# Altium schematic sheet Sensor Board.SchDoc
size 420 x 297 mm; Dosya adı / File Name: Sensor Board; Tanım / Description: Wireless Security Detector; Hazırlayan / Prepared By: MFY; Kontrol eden / Checked by: MFY; Onaylayan  /Approved by: MFY; Bölüm / Department: R&D - ARGE; Yayın Tarihi / Rel.date: 11.08.2025; Değ. tarihi / change date: 11.08.2025; Revizyon / Revision: AA; Size: A3
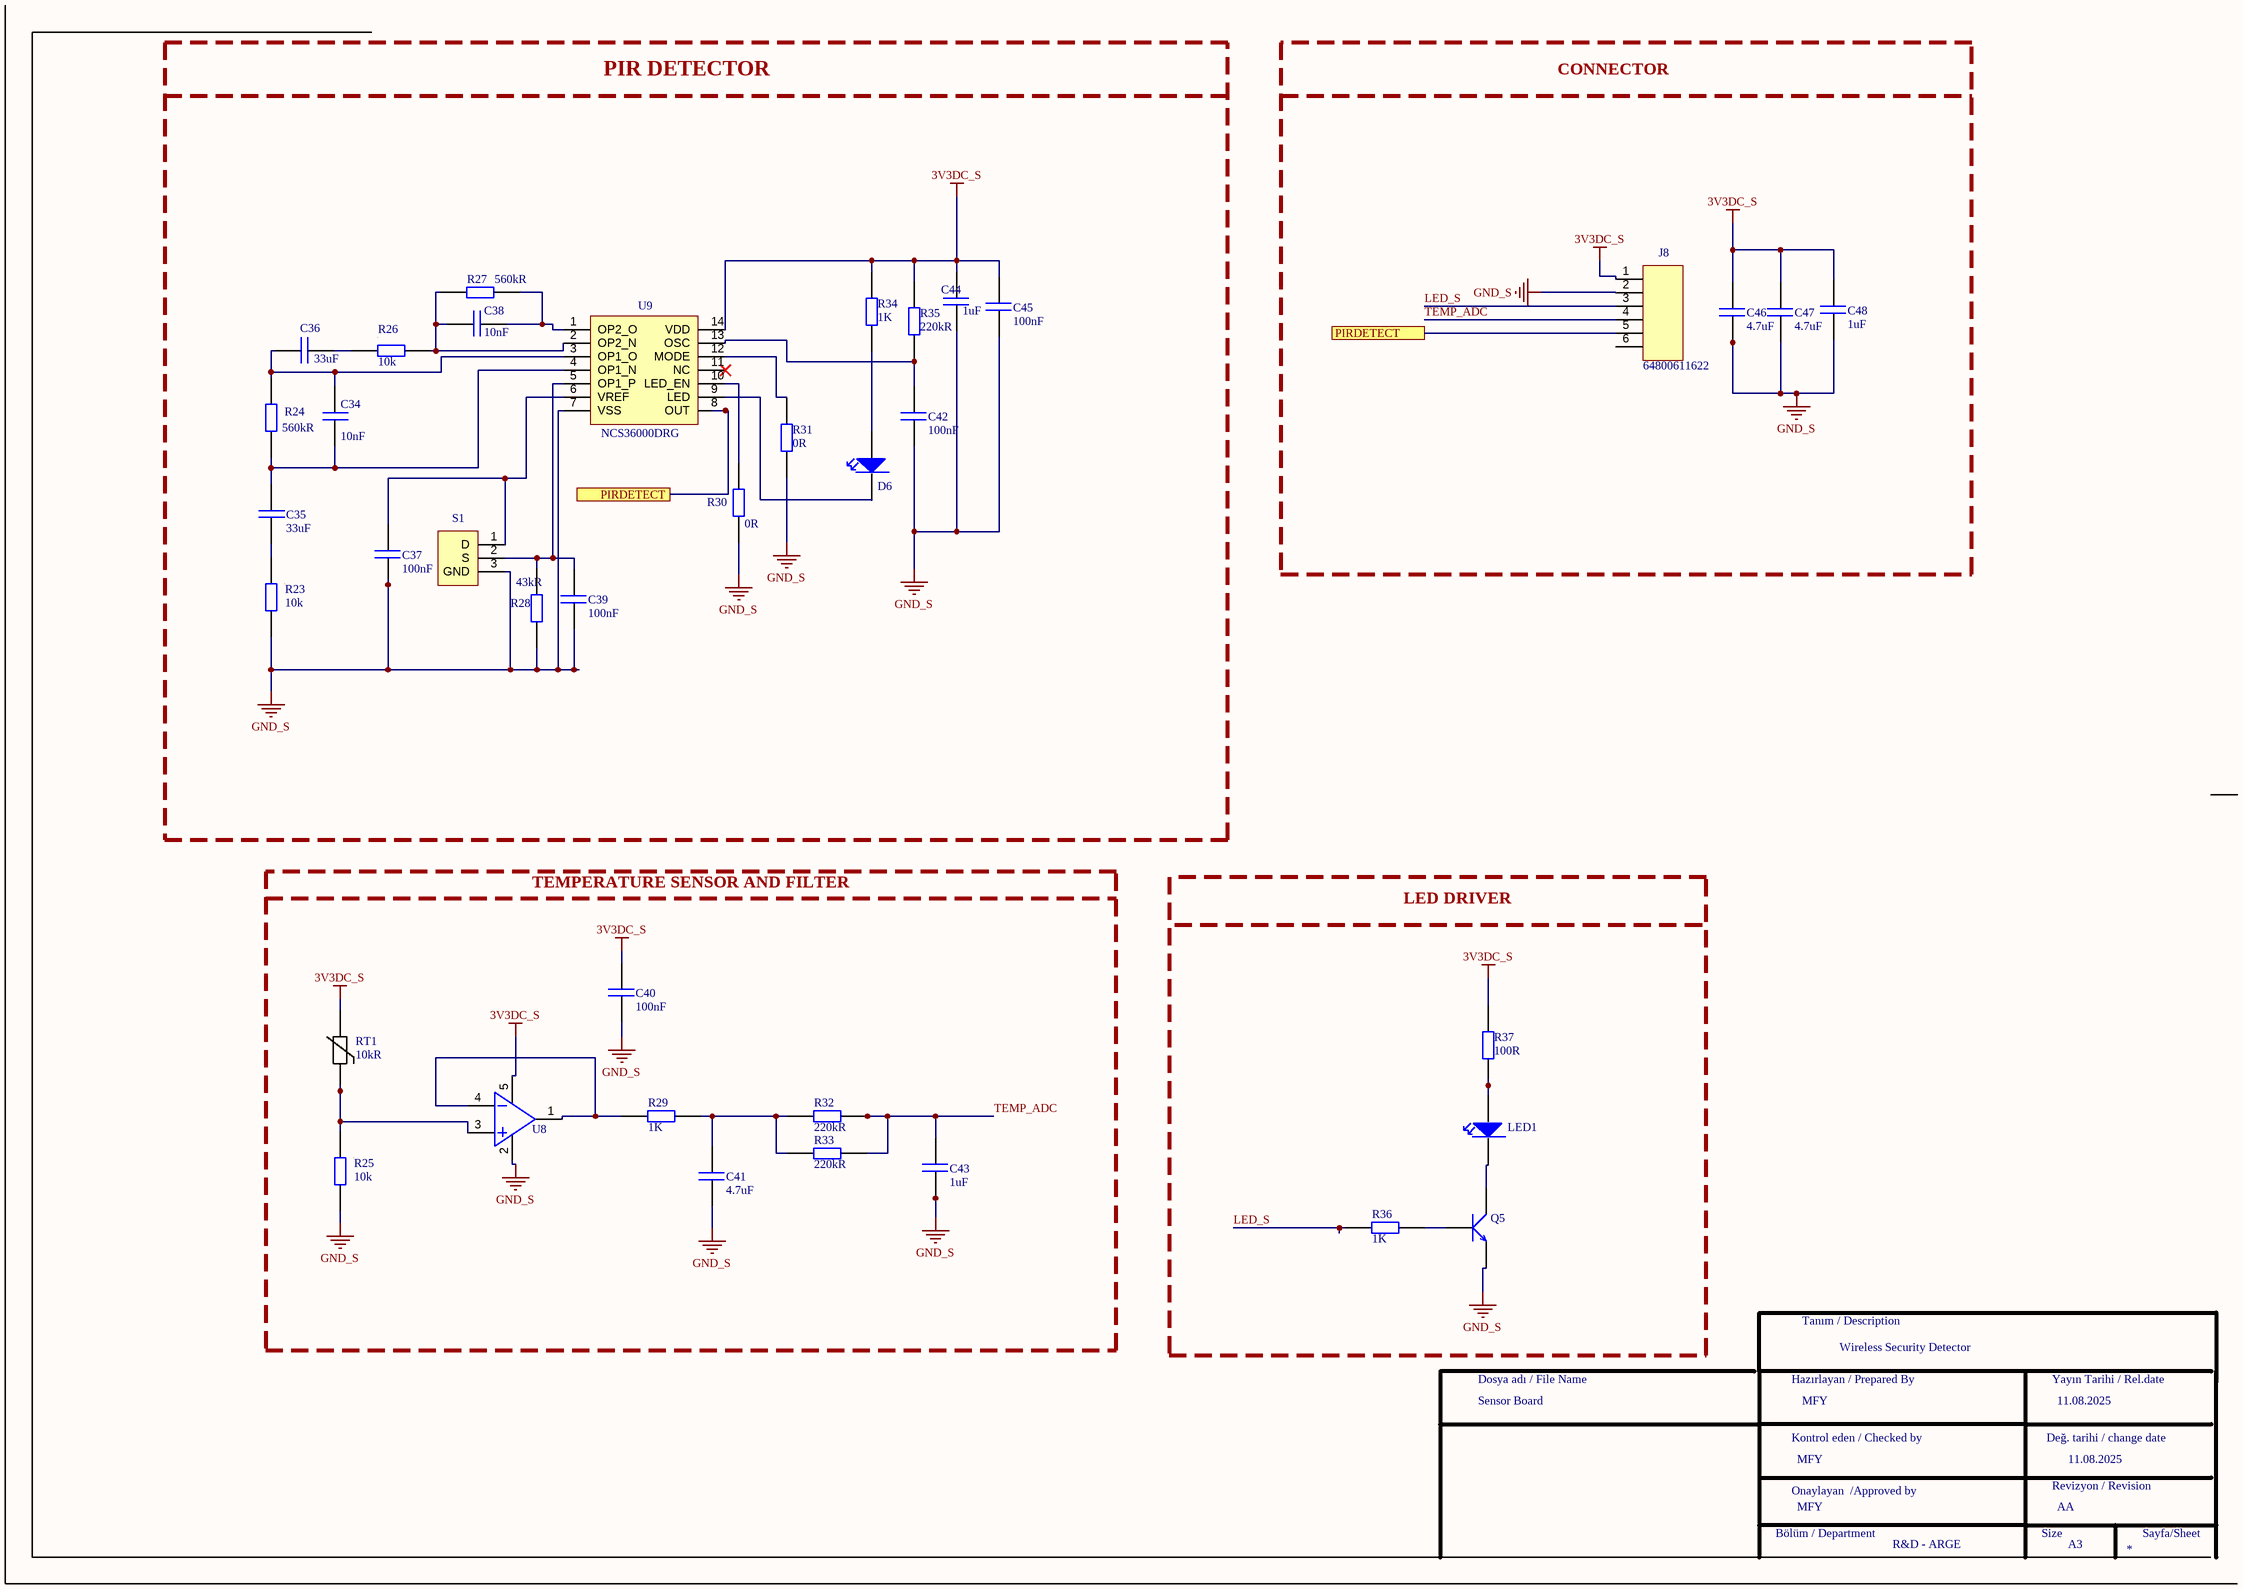
[diagram p0: Sensor Board.SchDoc]

## Parts
C34  value 10nF  [CAP_0603]  (hidden comment: 0603B103K160CT)
C35  value 33uF  [CAP_1206]  (hidden comment: C3216X5R1E336M160AC)
C36  value 33uF  [CAP_1206]  (hidden comment: C3216X5R1E336M160AC)
C37  value 100nF  [CAP_0603]  (hidden comment: CAP CER 100nF 0603)
C38  value 10nF  [CAP_0603]  (hidden comment: 0603B103K160CT)
C39  value 100nF  [CAP_0603]  (hidden comment: CAP CER 100nF 0603)
C40  value 100nF  [CAP_0603]  (hidden comment: CAP CER 100nF 0603)
C41  value 4.7uF  [CAP_0805]  (hidden comment: CL21A475KAQNNNE)
C42  value 100nF  [CAP_0603]  (hidden comment: CAP CER 100nF 0603)
C43  value 1uF  [CAP_0805]  (hidden comment: CL21B105KBFNNNE)
C44  value 1uF  [CAP_0805]  (hidden comment: CL21B105KBFNNNE)
C45  value 100nF  [CAP_0603]  (hidden comment: CAP CER 100nF 0603)
C46  value 4.7uF  [CAP_0805]  (hidden comment: CL21A475KAQNNNE)
C47  value 4.7uF  [CAP_0805]  (hidden comment: CL21A475KAQNNNE)
C48  value 1uF  [CAP_0805]  (hidden comment: CL21B105KBFNNNE)
D6  LTST-C171GKT  [LED_GREEN_0805]  (value not drawn)
J8  64800611622  [64800611622_WÜRTH_CONN]
LED1  LH R974-LP-1  [LED_RED_0805]  (value not drawn)
Q5  MMBT3904-7-F  [SOT23-F]  (value not drawn)
R23  value 10k  [RES_0603]  (hidden comment: RC0603FR-0710KL)
R24  value 560kR  [RES_0603]  (hidden comment: RC0603JR-07560KL)
R25  value 10k  [RES_0603]  (hidden comment: RC0603FR-0710KL)
R26  value 10k  [RES_0603]  (hidden comment: RC0603FR-0710KL)
R27  value 560kR  [RES_0603]  (hidden comment: RC0603JR-07560KL)
R28  value 43kR  [RES_0603]  (hidden comment: RC0603JR-0743KL)
R29  value 1K  [RES_0603]  (hidden comment: RES 1K OHM 0603)
R30  value 0R  [RES_0603]  (hidden comment: RC0603JR-070RL)
R31  value 0R  [RES_0603]  (hidden comment: RC0603JR-070RL)
R32  value 220kR  [RES_0603]  (hidden comment: RC0603JR-07220KL)
R33  value 220kR  [RES_0603]  (hidden comment: RC0603JR-07220KL)
R34  value 1K  [RES_0603]  (hidden comment: RES 1K OHM 0603)
R35  value 220kR  [RES_0603]  (hidden comment: RC0603JR-07220KL)
R36  value 1K  [RES_0603]  (hidden comment: RES 1K OHM 0603)
R37  value 100R  [RES_0603]  (hidden comment: RES 100 OHM 0603)
RT1  value 10kR  [RES_1206]  (hidden comment: TFPT1206L1002FM)
S1  LHI 878/3902  [LHI 878/3902]  (value not drawn)
U8  OPA314AIDBVR  [SOT23-5]  (value not drawn)
U9  NCS36000DRG  [SOIC14]

## Blocks framed on the sheet
PIR DETECTOR: C34-C39 C42 C44 C45 D6 R23 R24 R26-R28 R30 R31 R34 R35 S1 U9
CONNECTOR: C46-C48 J8
TEMPERATURE SENSOR AND FILTER: C40 C41 C43 R25 R29 R32 R33 RT1 U8

## Ports
PIRDETECT (see Sensor Board[2B]), PIRDETECT (see Sensor Board[4A])

## Nets
3V3DC_S: C40.2 C44.2 C45.2 C46.2 C47.2 C48.2 J8.1(VCC) R34.2 R35.2 R37.1 RT1.2 U8.5 U9.14(VDD)
GND_S: C37.1 C39.1 C40.1 C41.1 C42.1 C43.1 C44.1 C45.1 C46.1 C47.1 C48.1 J8.2(RX) Q5.2(E) R23.2 R25.2 R28.1 R30.1 R31.1 S1.3(GND) U8.2 U9.7(VSS)
LED_S: J8.3(RX) R36.1
PIRDETECT: J8.5(GND) U9.8(OUT) ; port PIRDETECT
TEMP_ADC: C43.2 J8.4(NC) R32.2 R33.2
NetC34_1: C34.1 C36.1 R24.1 U9.3(OP1_O)
NetC34_2: C34.2 C35.1 R24.2 U9.4(OP1_N)
NetC35_2: C35.2 R23.1
NetC36_2: C36.2 R26.1
NetC37_2: C37.2 S1.1(D) U9.6(VREF)
NetC38_1: C38.1 R26.2 R27.1 U9.2(OP2_N)
NetC38_2: C38.2 R27.2 U9.1(OP2_O)
NetC39_2: C39.2 R28.2 S1.2(S) U9.5(OP1_P)
NetC41_2: C41.2 R29.2 R32.1 R33.1
NetC42_2: C42.2 R35.1 U9.13(OSC)
NetD6_1: D6.1 U9.9(LED)
NetD6_2: D6.2 R34.1
NetLED1_1: LED1.1 Q5.3(C)
NetLED1_2: LED1.2 R37.2
NetQ5_1: Q5.1(B) R36.2
NetR25_1: R25.1 RT1.1 U8.3
NetR29_1: R29.1 U8.1 U8.4
NetR30_2: R30.2 U9.10(LED_EN)
NetR31_2: R31.2 U9.12(MODE)

Not connected (* = marked no-connect by the designer): J8 6(GND); U9 11(NC)*

## Notes on the sheet
- LED DRIVER
- Tanım / Description
- Dosya adı / File Name
- Hazırlayan / Prepared By
- Yayın Tarihi / Rel.date
- Kontrol eden / Checked by
- Değ. tarihi / change date
- Bölüm / Department
- Onaylayan  /Approved by
- Size
- Revizyon / Revision
- Sayfa/Sheet

## Library data of the parts
C34 C38 = CAP CER 10nF 0603: Ceramic Capacitor, Multilayer, Ceramic, 16V, 10% +Tol, 10% -Tol, X7R, 15% TC, 0.01uF, Surface Mount, 0603; Manufacturer: Walsin Technologies; Multilayer: Yes; Supplier: Mouser; Supplier Part Number: 791-0603B103K160CT; Manufacturer Part Number: 0603B103K160CT; RoHS: Yes; Category: Ceramic Capacitors; Stock: 5599; Pricing: 1=0,1, 10=0,017, 50=0,017, 100=0,01, 1000=0,006, 10000=0,003 (USD); Mounting Technology: Surface Mount; Pins: 2; Dielectric Material: Ceramic; Case/Package: 0603; Package Shape: Rectangular; Terminal Finish: Nickel; Min Operating Temperature: -55°C; Max Operating Temperature: 125°C; Capacitor Type: Ceramic; Tolerance  (fill in as +-): 10%; Package Style: SMTMeter; Packaging: Tape and Reel; Tolerance (fill in as +-): 10%; Rated DC Voltage (URdc): 16V; Temperature Characteristics Code: X7R; JESD-609 Code: e3; Termination: Wraparound; Length: 1.6mm; Width: 0.8mm; Height: 0.8mm; Reach SVHC Compliant: Yes; RoHS Compliant: Yes; ComponentLink1URL: https://datasheet.ciiva.com:443/pdfs/VipMasterIC/IC/WATC/WATC-S-A0009550342/WATC-S-A0009550342-1.pdf?src-supplier=IHS+Markit; ComponentLink1Description: https://datasheet.ciiva.com:443/pdfs/VipMasterIC/IC/WATC/WATC-S-A0009550342/WATC-S-A0009550342-1.pdf?src-supplier=IHS+Markit; ComponentLink2URL: http://www.farnell.com/datasheets/1958513.pdf?src-supplier=Farnell; ComponentLink2Description: http://www.farnell.com/datasheets/1958513.pdf?src-supplier=Farnell; ComponentLink3URL: https://datasheet.octopart.com/0603B103K160CT-Walsin-Technologies-datasheet-85392065.pdf?src-supplier=Element14; ComponentLink3Description: https://datasheet.octopart.com/0603B103K160CT-Walsin-Technologies-datasheet-85392065.pdf?src-supplier=Element14; ComponentLink4URL: http://www.passivecomponent.com/wp-content/uploads/2018/10/MLCC.pdf?src-supplier=Digikey; ComponentLink4Description: http://www.passivecomponent.com/wp-content/uploads/2018/10/MLCC.pdf?src-supplier=Digikey; ComponentLink5URL: https://datasheet.octopart.com/0603B103K160CT-Walsin-Technologies-datasheet-136037192.pdf?src-supplier=Future+Electronics; ComponentLink5Description: https://datasheet.octopart.com/0603B103K160CT-Walsin-Technologies-datasheet-136037192.pdf?src-supplier=Future+Electronics; ComponentLink6URL: https://datasheet.octopart.com/0603B103K160CT-Walsin-Technologies-datasheet-62066062.pdf?src-supplier=TME; ComponentLink6Description: https://datasheet.octopart.com/0603B103K160CT-Walsin-Technologies-datasheet-62066062.pdf?src-supplier=TME
C35 C36 = CAP CER 33uF 1206: Ceramic Capacitor, Multilayer, Ceramic, 25V, 20% +Tol, 20% -Tol, X5R, 15% TC, 33uF, Surface Mount, 1206; Manufacturer: TDK; Multilayer: Yes; Supplier: Mouser; Supplier Part Number: 810-C3216X5R1E336M; Manufacturer Part Number: C3216X5R1E336M160AC; RoHS: Yes; Category: Ceramic Capacitors; Stock: 141431; Pricing: 1=1,13, 10=0,572, 50=0,572, 100=0,51, 1000=0,416, 10000=0,337 (USD); Mounting Technology: Surface Mount; Pins: 2; Dielectric Material: Ceramic; Package Shape: Rectangular; Case/Package: 1206; Terminal Finish: Nickel; Min Operating Temperature: -55°C; Max Operating Temperature: 85°C; JESD-609 Code: e3; Capacitor Type: Ceramic; Tolerance  (fill in as +-): 20%; Package Style: SMTMeter; Packaging: Tape and Reel; Tolerance (fill in as +-): 20%; Rated DC Voltage (URdc): 25V; Temperature Characteristics Code: X5R; Termination: Wraparound; Length: 3.2mm; Width: 1.6mm; Height: 1.6mm; Reach SVHC Compliant: Yes; RoHS Compliant: Yes; ComponentLink1URL: https://datasheet.ciiva.com:443/pdfs/VipMasterIC/IC/TDKC/TDKC-S-A0008796792/TDKC-S-A0008796792-1.pdf?src-supplier=IHS+Markit; ComponentLink1Description: https://datasheet.ciiva.com:443/pdfs/VipMasterIC/IC/TDKC/TDKC-S-A0008796792/TDKC-S-A0008796792-1.pdf?src-supplier=IHS+Markit; ComponentLink2URL: https://datasheet.ciiva.com/24216/c3216x5r1e336m160ac-265051-24216512.pdf?src-supplier=Mouser; ComponentLink2Description: https://datasheet.ciiva.com/24216/c3216x5r1e336m160ac-265051-24216512.pdf?src-supplier=Mouser; ComponentLink3URL: https://datasheet.ciiva.com/6285/tdkmlcccaprange-6285278.pdf?src-supplier=Digikey; ComponentLink3Description: https://datasheet.ciiva.com/6285/tdkmlcccaprange-6285278.pdf?src-supplier=Digikey
C37 C39 C40 C42 C45 = CAP CER 100nF 0603: CAP CER %10 100 nF 0603 Kemet; Manufacturer Part Number: C0603C104K5RACTU; Dielectric Material: Ceramic; Multilayer: Yes; Tolerance  (fill in as +-): 10%; Rated DC Voltage (URdc): 50V; Temperature Characteristics Code: X7R; Supplier: Mouser; Supplier Part Number: 80-C0603C104K5R; Manufacturer: KEMET; RoHS: Yes; Category: Ceramic Capacitors; Stock: 2298151; Pricing: 1=0,1, 10=0,012, 50=0,012, 100=0,011, 1000=0,011, 10000=0,01 (USD); Mounting Technology: Surface Mount; Pins: 2; Package Shape: Rectangular; Case/Package: 0603; Terminal Finish: Nickel; Min Operating Temperature: -55°C; Max Operating Temperature: 125°C; JESD-609 Code: e3; Capacitor Type: Ceramic; Package Style: SMTMeter; Packaging: Tape and Reel; Tolerance (fill in as +-): 10%; Termination: Wraparound; Length: 1.6mm; Width: 0.8mm; Height: 0.8mm; Reach SVHC Compliant: Yes; RoHS Compliant: Yes; ComponentLink1URL: https://datasheet.ciiva.com:443/pdfs/VipMasterIC/IC/KEME/KEME-S-A0008991654/KEME-S-A0008991654-1.pdf?src-supplier=IHS+Markit; ComponentLink1Description: https://datasheet.ciiva.com:443/pdfs/VipMasterIC/IC/KEME/KEME-S-A0008991654/KEME-S-A0008991654-1.pdf?src-supplier=IHS+Markit; ComponentLink2URL: https://datasheet.ciiva.com/7823/kem-c1002-x7r-smd-7823592.pdf?src-supplier=Element14; ComponentLink2Description: https://datasheet.ciiva.com/7823/kem-c1002-x7r-smd-7823592.pdf?src-supplier=Element14; ComponentLink3URL: https://datasheet.ciiva.com/28645/1851736-28645640.pdf?src-supplier=Element14; ComponentLink3Description: https://datasheet.ciiva.com/28645/1851736-28645640.pdf?src-supplier=Element14; ComponentLink4URL: https://datasheet.ciiva.com/14602/70095383-14602583.pdf?src-supplier=Allied+Electronics; ComponentLink4Description: https://datasheet.ciiva.com/14602/70095383-14602583.pdf?src-supplier=Allied+Electronics; ComponentLink5URL: https://datasheet.ciiva.com/7823/kem-c1002-x7r-smd-7823591.pdf?src-supplier=Element14; ComponentLink5Description: https://datasheet.ciiva.com/7823/kem-c1002-x7r-smd-7823591.pdf?src-supplier=Element14; ComponentLink6URL: https://datasheet.ciiva.com/5999/kem-c1002-x7r-smd-5999400.pdf?src-supplier=Farnell; ComponentLink6Description: https://datasheet.ciiva.com/5999/kem-c1002-x7r-smd-5999400.pdf?src-supplier=Farnell; ComponentLink7URL: https://datasheet.ciiva.com/14585/70095383-14585209.pdf?src-supplier=Allied+Electronics; ComponentLink7Description: https://datasheet.ciiva.com/14585/70095383-14585209.pdf?src-supplier=Allied+Electronics
C41 C46 C47 = CAP CER 4.7uF 0805: Ceramic Capacitor, Multilayer, Ceramic, 25V, 10% +Tol, 10% -Tol, X5R, 15% TC, 4.7uF, Surface Mount, 0805; Manufacturer: Samsung; Multilayer: Yes; Supplier: Mouser; Supplier Part Number: 187-CL21A475KAQNNNE; Manufacturer Part Number: CL21A475KAQNNNE; RoHS: Yes; Category: Ceramic Capacitors; Stock: 101326; Pricing: 1=0,1, 10=0,039, 50=0,039, 100=0,032, 1000=0,022, 10000=0,012 (USD); Mounting Technology: Surface Mount; Pins: 2; Dielectric Material: Ceramic; Package Shape: Rectangular; Case/Package: 0805; Terminal Finish: Nickel; Min Operating Temperature: -55°C; Max Operating Temperature: 85°C; JESD-609 Code: e3; Capacitor Type: Ceramic; Tolerance  (fill in as +-): 10%; Package Style: SMTMeter; Packaging: Tape and Reel; Tolerance (fill in as +-): 10%; Rated DC Voltage (URdc): 25V; Temperature Characteristics Code: X5R; Termination: Wraparound; Length: 2mm; Width: 1.25mm; Height: 1.4mm; Reach SVHC Compliant: Yes; RoHS Compliant: Yes; ComponentLink1URL: https://datasheet.ciiva.com:443/pdfs/VipMasterIC/IC/SEMS/SEMS-S-A0008528919/SEMS-S-A0008528938-1.pdf?src-supplier=IHS+Markit; ComponentLink1Description: https://datasheet.ciiva.com:443/pdfs/VipMasterIC/IC/SEMS/SEMS-S-A0008528919/SEMS-S-A0008528938-1.pdf?src-supplier=IHS+Markit; ComponentLink2URL: https://datasheet.ciiva.com/25798/cl21a475kaqnnne-25798882.pdf?src-supplier=Digikey; ComponentLink2Description: https://datasheet.ciiva.com/25798/cl21a475kaqnnne-25798882.pdf?src-supplier=Digikey
C43 C44 C48 = CAP CER 1uF 0805: Ceramic Capacitor, Multilayer, Ceramic, 50V, 10% +Tol, 10% -Tol, X7R, 15% TC, 1uF, Surface Mount, 0805; Manufacturer: Samsung; Multilayer: Yes; Supplier: Mouser; Supplier Part Number: 187-CL21B105KBFNNNE; Manufacturer Part Number: CL21B105KBFNNNE; RoHS: Yes; Category: Ceramic Capacitors; Stock: 619004; Pricing: 1=0,1, 10=0,016, 50=0,016, 100=0,013, 1000=0,013, 10000=0,011 (USD); Mounting Technology: Surface Mount; Pins: 2; Dielectric Material: Ceramic; Package Shape: Rectangular; Case/Package: 0805; Terminal Finish: Nickel; Min Operating Temperature: -55°C; Max Operating Temperature: 125°C; JESD-609 Code: e3; Capacitor Type: Ceramic; Tolerance  (fill in as +-): 10%; Package Style: SMTMeter; Packaging: Tape and Reel; Tolerance (fill in as +-): 10%; Rated DC Voltage (URdc): 50V; Temperature Characteristics Code: X7R; Termination: Wraparound; Length: 2mm; Width: 1.25mm; Height: 1.35mm; Reach SVHC Compliant: Yes; RoHS Compliant: Yes; ComponentLink1URL: https://datasheet.ciiva.com:443/pdfs/VipMasterIC/IC/SEMS/SEMS-S-A0008524728/SEMS-S-A0008523023-1.pdf?src-supplier=IHS+Markit; ComponentLink1Description: https://datasheet.ciiva.com:443/pdfs/VipMasterIC/IC/SEMS/SEMS-S-A0008524728/SEMS-S-A0008523023-1.pdf?src-supplier=IHS+Markit; ComponentLink2URL: https://datasheet.ciiva.com/16449/cl21b105kbfnnne-16449003.pdf?src-supplier=Future+Electronics; ComponentLink2Description: https://datasheet.ciiva.com/16449/cl21b105kbfnnne-16449003.pdf?src-supplier=Future+Electronics; ComponentLink3URL: https://datasheet.ciiva.com/25800/cl21b105kbfnnne-25800291.pdf?src-supplier=Digikey; ComponentLink3Description: https://datasheet.ciiva.com/25800/cl21b105kbfnnne-25800291.pdf?src-supplier=Digikey
D6 = LED_GREEN_0805: Single Color LED, Green, Water Clear, 1.4mm; Manufacturer: Vishay Lite-On; Shape: Rectangular; Forward Current: 30mA; Forward Voltage: 2.6V; Luminous Intensity-Nom: 12mcd; Channels: 1; Reverse Voltage-Max: 5V; Viewing Angle: 130°; Overall Height: 0.8mm; Supplier: Arrow Electronics; Supplier Part Number: LTST-C171GKT; Manufacturer Part Number: LTST-C171GKT; RoHS: Yes; Category: LEDs; Stock: 33000; Pricing: 3000=0,0329, 6000=0,032, 9000=0,03, 24000=0,03 (USD); Mounting Technology: Surface Mount; Pins: 2; Color: Green; Color@wavelength: Green; Terminal Finish: Gold; Min Operating Temperature: -55°C; Max Operating Temperature: 85°C; JESD-609 Code: e4; Lens Style: WATER CLEAR; Optoelectronic Device Type: SINGLE COLOR LED; Packaging: Tape and Reel; Size: 1.4mm; Terminal Pitch: 2.5mm; Reach SVHC Compliant: Yes; RoHS Compliant: Yes; ComponentLink1URL: https://datasheet.ciiva.com:443/pdfs/VipMasterIC/IC/LITE/LITES06193/LITES06193-1.pdf?src-supplier=IHS+Markit; ComponentLink1Description: https://datasheet.ciiva.com:443/pdfs/VipMasterIC/IC/LITE/LITES06193/LITES06193-1.pdf?src-supplier=IHS+Markit; ComponentLink2URL: https://datasheet.ciiva.com/2110/ltst-c171gkt-2110000.pdf?src-supplier=Digikey; ComponentLink2Description: https://datasheet.ciiva.com/2110/ltst-c171gkt-2110000.pdf?src-supplier=Digikey; ComponentLink3URL: https://datasheet.ciiva.com/11773/0900766b80dc0296-11773991.pdf?src-supplier=Rs; ComponentLink3Description: https://datasheet.ciiva.com/11773/0900766b80dc0296-11773991.pdf?src-supplier=Rs; ComponentLink4URL: https://datasheet.ciiva.com/12400/lite-on-ltst-c171gkt-190133-12400647.pdf?src-supplier=Mouser; ComponentLink4Description: https://datasheet.ciiva.com/12400/lite-on-ltst-c171gkt-190133-12400647.pdf?src-supplier=Mouser; ComponentLink5URL: https://datasheet.ciiva.com/2110/ltst-c171gkt-2110001.pdf?src-supplier=Digikey; ComponentLink5Description: https://datasheet.ciiva.com/2110/ltst-c171gkt-2110001.pdf?src-supplier=Digikey; ComponentLink6URL: https://datasheet.ciiva.com/2110/ltst-c171gkt-2110002.pdf?src-supplier=Digikey; ComponentLink6Description: https://datasheet.ciiva.com/2110/ltst-c171gkt-2110002.pdf?src-supplier=Digikey; ComponentLink7URL: https://datasheet.ciiva.com/16396/ltst-c171gkt-16396549.pdf?src-supplier=Future+Electronics; ComponentLink7Description: https://datasheet.ciiva.com/16396/ltst-c171gkt-16396549.pdf?src-supplier=Future+Electronics
J8 = 64800611622_CONN_6PIN: WR-WTB Wire-to-Board Connectors 1.50 mm(ANA KARTTAN SENSOR KARTA); Manufacturer: Wurth Electronics; Supplier: Farnell; Supplier Part Number: 3818179; Manufacturer Part Number: 64800611622; RoHS: No; Category: Uncategorized; Stock: 148; Pricing: 10=0,375, 100=0,297, 500=0,262, 1000=0,257, 2500=0,252 (EUR)
LED1 = LED RED 0805: Red 645nm LED Indication - Discrete 1.8V 0805 (2012 Metric)
Q5 = MMBT3904-7-F: Small Signal Bipolar Transistor, 0.2A I(C), 40V V(BR)CEO, 1-Element, NPN, Silicon SOT-23F (DAHA ÖNCEDEN footprinti VARDI).; Manufacturer: Diodes Zetex; Package Body Material: Plastic; Additional Feature: HIGH RELIABILITY; Max Collector Current: 200mA; DC Current Gain-Min (hFE): 30; Number of Elements: 1; Power Dissipation-Max (Abs): 300mW; Time @ Peak Reflow Temperature-Max (s): 40s; Transistor Application: SWITCHING; Frequency: 300MHz; Turn-off Time-Max (toff): 250ns; Turn-on Time-Max (ton): 70ns; Qualification Status: Not Qualified; DESIGNED BY: MFY; Supplier: Mouser; Supplier Part Number: 621-MMBT3904-F; Manufacturer Part Number: MMBT3904-7-F; RoHS: Yes; Category: BJTs; Stock: 1405536; Pricing: 1=0,11, 10=0,052, 50=0,052, 100=0,036, 1000=0,025, 10000=0,016 (USD); Pins: 3; Package Shape: Rectangular; Terminal Finish: Tin; Transistor Element Material: SILICON; Max Operating Temperature: 150°C; JESD-609 Code: e3; Polarity/Channel Type: NPN; Collector-emitter Voltage-Max: 40V; JESD-30 Code: R-PDSO-G3; Moisture Sensitivity Level: 1; Package Style: SMALL OUTLINEMeter; Peak Reflow Temperature (Cel): 260°C; Surface Mount: Yes; Terminal Form: Gull Wing; Terminal Position: DUAL; Reach SVHC Compliant: Yes; RoHS Compliant: Yes; ComponentLink1URL: https://datasheet.ciiva.com:443/pdfs/VipMasterIC/IC/DIOD/DIOD-S-A0003133141/DIOD-S-A0003133141-1.pdf?src-supplier=IHS+Markit; ComponentLink1Description: https://datasheet.ciiva.com:443/pdfs/VipMasterIC/IC/DIOD/DIOD-S-A0003133141/DIOD-S-A0003133141-1.pdf?src-supplier=IHS+Markit; ComponentLink2URL: https://datasheet.ciiva.com/11201/ds30036-11201778.pdf?src-supplier=Avnet; ComponentLink2Description: https://datasheet.ciiva.com/11201/ds30036-11201778.pdf?src-supplier=Avnet; ComponentLink3URL: https://datasheet.ciiva.com/15138/getdatasheetpartid-53265-15138780.pdf?src-supplier=Verical; ComponentLink3Description: https://datasheet.ciiva.com/15138/getdatasheetpartid-53265-15138780.pdf?src-supplier=Verical; ComponentLink4URL: https://datasheet.ciiva.com/22711/1915516-22711750.pdf?src-supplier=Element14; ComponentLink4Description: https://datasheet.ciiva.com/22711/1915516-22711750.pdf?src-supplier=Element14; ComponentLink5URL: https://datasheet.ciiva.com/11198/ds30036-11198999.pdf?src-supplier=Avnet; ComponentLink5Description: https://datasheet.ciiva.com/11198/ds30036-11198999.pdf?src-supplier=Avnet; ComponentLink6URL: https://datasheet.ciiva.com/6361/ds30036-6361256.pdf?src-supplier=Digikey; ComponentLink6Description: https://datasheet.ciiva.com/6361/ds30036-6361256.pdf?src-supplier=Digikey; ComponentLink7URL: https://datasheet.ciiva.com/6361/ds30036-6361254.pdf?src-supplier=Digikey; ComponentLink7Description: https://datasheet.ciiva.com/6361/ds30036-6361254.pdf?src-supplier=Digikey
R23 R25 R26 = RES 10K OHM 0603: RES 10K %1 OHM 0603 SMD; Manufacturer: Yageo Group; DESIGNED BY: MFY; Supplier: Farnell; Supplier Part Number: 9238603; Manufacturer Part Number: RC0603FR-0710KL; RoHS: No; Category: Chip SMD Resistors; Stock: 451311; Pricing: 10=0,0085, 100=0,0066, 500=0,0063, 1000=0,0047, 2500=0,0037 (EUR); ComponentLink1URL: https://datasheet.octopart.com/RC0603FR-0710KL-Yageo-datasheet-62067350.pdf?src-supplier=Element14; ComponentLink1Description: https://datasheet.octopart.com/RC0603FR-0710KL-Yageo-datasheet-62067350.pdf?src-supplier=Element14; ComponentLink2URL: https://datasheet.octopart.com/RC0603FR-0710KL-Yageo-datasheet-15599030.pdf?src-supplier=Future+Electronics; ComponentLink2Description: https://datasheet.octopart.com/RC0603FR-0710KL-Yageo-datasheet-15599030.pdf?src-supplier=Future+Electronics; ComponentLink3URL: https://datasheet.octopart.com/RC0603FR-0710KL-Yageo-datasheet-118562.pdf?src-supplier=Digikey; ComponentLink3Description: https://datasheet.octopart.com/RC0603FR-0710KL-Yageo-datasheet-118562.pdf?src-supplier=Digikey; ComponentLink4URL: https://datasheet.octopart.com/RC0603FR-0710KL-Yageo-datasheet-12596169.pdf?src-supplier=Newark; ComponentLink4Description: https://datasheet.octopart.com/RC0603FR-0710KL-Yageo-datasheet-12596169.pdf?src-supplier=Newark; ComponentLink5URL: https://datasheet.octopart.com/RC0603FR-0710KL-Yageo-datasheet-8328172.pdf?src-supplier=Farnell; ComponentLink5Description: https://datasheet.octopart.com/RC0603FR-0710KL-Yageo-datasheet-8328172.pdf?src-supplier=Farnell; Case/Package: 0603
R24 R27 = RES 560K OHM 0603: 560K %5 RES , Surface Mount, 0603; Manufacturer: Yageo; Tolerance: 5%; Additional Feature: LASER TRIMMABLE; Power: 100mW; Rated Temperature: 70°C; Working Voltage: 75V; Temperature Coefficient (ppm/Cel): 100; Package Height: 0.45mm; Package Length: 1.6mm; Package Width: 0.8mm; Supplier: Mouser; Supplier Part Number: 603-RC0603JR-07560KL; Manufacturer Part Number: RC0603JR-07560KL; RoHS: Yes; Category: Chip SMD Resistors; Stock: 26754; Pricing: 1=0,1, 10=0,007, 50=0,007, 100=0,005, 1000=0,005, 10000=0,002 (USD); Mounting Technology: Surface Mount; Pins: 2; Package Shape: Rectangular; Case/Package: 0603; Terminal Finish: Nickel; Min Operating Temperature: -55°C; Max Operating Temperature: 155°C; JESD-609 Code: e3; Resistor Type: FIXED RESISTOR; Construction: Chip; Packaging: Tape and Reel; Technology: METAL GLAZE/THICK FILM; Termination: Wraparound; Reach SVHC Compliant: Yes; RoHS Compliant: Yes; ComponentLink1URL: https://datasheet.ciiva.com:443/pdfs/VipMasterIC/IC/YAGO/YAGO-S-A0008145938/YAGO-S-A0008145938-1.pdf?src-supplier=IHS+Markit; ComponentLink1Description: https://datasheet.ciiva.com:443/pdfs/VipMasterIC/IC/YAGO/YAGO-S-A0008145938/YAGO-S-A0008145938-1.pdf?src-supplier=IHS+Markit; ComponentLink2URL: https://datasheet.ciiva.com/2453/pyu-r-int-thick-7-2453055.pdf?src-supplier=Digikey; ComponentLink2Description: https://datasheet.ciiva.com/2453/pyu-r-int-thick-7-2453055.pdf?src-supplier=Digikey; ComponentLink3URL: https://datasheet.ciiva.com/2453/pyu-r-int-thick-7-2453056.pdf?src-supplier=Digikey; ComponentLink3Description: https://datasheet.ciiva.com/2453/pyu-r-int-thick-7-2453056.pdf?src-supplier=Digikey; ComponentLink4URL: https://datasheet.ciiva.com/2453/pyu-r-int-thick-7-2453057.pdf?src-supplier=Digikey; ComponentLink4Description: https://datasheet.ciiva.com/2453/pyu-r-int-thick-7-2453057.pdf?src-supplier=Digikey
R28 = RES 43K OHM 0603: 0.1W, 43Kohm, 75V, 5% +/-Tol, 100ppm/Cel, Surface Mount, 0603; Manufacturer: Yageo; Additional Feature: LASER TRIMMABLE; Power: 100mW; Rated Temperature: 70°C; Temperature Coefficient (ppm/Cel): 100; Package Height: 0.45mm; Package Length: 1.6mm; Package Width: 0.8mm; Supplier: Mouser; Supplier Part Number: 603-RC0603JR-0743KL; Manufacturer Part Number: RC0603JR-0743KL; RoHS: Yes; Category: Chip SMD Resistors; Stock: 173885; Pricing: 1=0,1, 10=0,005, 50=0,005, 100=0,005, 1000=0,005, 10000=0,001 (USD); Mounting Technology: Surface Mount; Pins: 2; Package Shape: Rectangular; Case/Package: 0603; Terminal Finish: Nickel; Min Operating Temperature: -55°C; Max Operating Temperature: 155°C; Tolerance: 5%; JESD-609 Code: e3; Resistor Type: FIXED RESISTOR; Construction: Chip; Packaging: Tape and Reel; Technology: METAL GLAZE/THICK FILM; Termination: Wraparound; Working Voltage: 75V; Reach SVHC Compliant: Yes; RoHS Compliant: Yes; ComponentLink1URL: https://datasheet.ciiva.com:443/pdfs/VipMasterIC/IC/YAGO/YAGO-S-A0008145938/YAGO-S-A0008145938-1.pdf?src-supplier=IHS+Markit; ComponentLink1Description: https://datasheet.ciiva.com:443/pdfs/VipMasterIC/IC/YAGO/YAGO-S-A0008145938/YAGO-S-A0008145938-1.pdf?src-supplier=IHS+Markit; ComponentLink2URL: https://datasheet.ciiva.com/2453/pyu-r-int-thick-7-2453052.pdf?src-supplier=Digikey; ComponentLink2Description: https://datasheet.ciiva.com/2453/pyu-r-int-thick-7-2453052.pdf?src-supplier=Digikey; ComponentLink3URL: https://datasheet.ciiva.com/2453/pyu-r-int-thick-7-2453053.pdf?src-supplier=Digikey; ComponentLink3Description: https://datasheet.ciiva.com/2453/pyu-r-int-thick-7-2453053.pdf?src-supplier=Digikey; ComponentLink4URL: https://datasheet.ciiva.com/2453/pyu-r-int-thick-7-2453054.pdf?src-supplier=Digikey; ComponentLink4Description: https://datasheet.ciiva.com/2453/pyu-r-int-thick-7-2453054.pdf?src-supplier=Digikey
R30 R31 = RES 0 OHM 0603: Metal Glaze/thick Film, 0.1W, 0ohm, Surface Mount, 0603; Manufacturer: Yageo; Power: 100mW; Rated Temperature: 70°C; Package Height: 0.45mm; Package Length: 1.6mm; Package Width: 0.8mm; Supplier: Mouser; Supplier Part Number: 603-RC0603JR-070RL; Manufacturer Part Number: RC0603JR-070RL; RoHS: Yes; Category: Chip SMD Resistors; Stock: 4490920; Pricing: 1=0,1, 10=0,007, 50=0,007, 100=0,005, 1000=0,004, 10000=0,003 (USD); Mounting Technology: Surface Mount; Pins: 2; Package Shape: Rectangular; Case/Package: 0603; Terminal Finish: Nickel; Min Operating Temperature: -55°C; Max Operating Temperature: 155°C; JESD-609 Code: e3; Resistor Type: FIXED RESISTOR; Construction: Chip; Packaging: Tape and Reel; Technology: METAL GLAZE/THICK FILM; Termination: Wraparound; Reach SVHC Compliant: Yes; RoHS Compliant: Yes; ComponentLink1URL: https://datasheet.ciiva.com:443/pdfs/VipMasterIC/IC/YAGO/YAGO-S-A0008145938/YAGO-S-A0008145938-1.pdf?src-supplier=IHS+Markit; ComponentLink1Description: https://datasheet.ciiva.com:443/pdfs/VipMasterIC/IC/YAGO/YAGO-S-A0008145938/YAGO-S-A0008145938-1.pdf?src-supplier=IHS+Markit
R32 R33 R35 = RES 220K OHM 0603: 0.1W, 220000ohm, 75V, 5% +/-Tol, 100ppm/Cel, Surface Mount, 0603; Manufacturer: Yageo; Additional Feature: LASER TRIMMABLE; Power: 100mW; Rated Temperature: 70°C; Temperature Coefficient (ppm/Cel): 100; Package Height: 0.45mm; Package Length: 1.6mm; Package Width: 0.8mm; Supplier: Mouser; Supplier Part Number: 603-RC0603JR-07220KL; Manufacturer Part Number: RC0603JR-07220KL; RoHS: Yes; Category: Chip SMD Resistors; Stock: 72147; Pricing: 1=0,1, 10=0,008, 50=0,008, 100=0,006, 1000=0,005, 10000=0,002 (USD); Mounting Technology: Surface Mount; Pins: 2; Package Shape: Rectangular; Case/Package: 0603; Terminal Finish: Nickel; Min Operating Temperature: -55°C; Max Operating Temperature: 155°C; Tolerance: 5%; JESD-609 Code: e3; Resistor Type: FIXED RESISTOR; Construction: Chip; Packaging: Tape and Reel; Technology: METAL GLAZE/THICK FILM; Termination: Wraparound; Working Voltage: 75V; Reach SVHC Compliant: Yes; RoHS Compliant: Yes; ComponentLink1URL: https://datasheet.ciiva.com:443/pdfs/VipMasterIC/IC/YAGO/YAGO-S-A0008145938/YAGO-S-A0008145938-1.pdf?src-supplier=IHS+Markit; ComponentLink1Description: https://datasheet.ciiva.com:443/pdfs/VipMasterIC/IC/YAGO/YAGO-S-A0008145938/YAGO-S-A0008145938-1.pdf?src-supplier=IHS+Markit; ComponentLink2URL: https://datasheet.ciiva.com/2452/pyu-r-int-thick-7-2452923.pdf?src-supplier=Digikey; ComponentLink2Description: https://datasheet.ciiva.com/2452/pyu-r-int-thick-7-2452923.pdf?src-supplier=Digikey; ComponentLink3URL: https://datasheet.ciiva.com/2452/pyu-r-int-thick-7-2452924.pdf?src-supplier=Digikey; ComponentLink3Description: https://datasheet.ciiva.com/2452/pyu-r-int-thick-7-2452924.pdf?src-supplier=Digikey; ComponentLink4URL: https://datasheet.ciiva.com/2452/pyu-r-int-thick-7-2452925.pdf?src-supplier=Digikey; ComponentLink4Description: https://datasheet.ciiva.com/2452/pyu-r-int-thick-7-2452925.pdf?src-supplier=Digikey
RT1 = TFPT1206L1002FM: Thermistor PTC 10K Ohm 1% 2-Pin 1206 Surface Mount; Manufacturer: Vishay Dale; DESIGNED BY: MFY; Power Rating: 125mW; Voltage: 40V; Supplier: Mouser; Supplier Part Number: 71-TFPT1206L1002FM; Manufacturer Part Number: TFPT1206L1002FM; RoHS: Yes; Category: Linear ICs; Stock: 33485; Pricing: 1=0,81, 10=0,751, 50=0,567, 100=0,554, 1000=0,514, 10000=0,462 (USD); Mounting Technology: Surface Mount; Case/Package: 1206; Case Code (Imperial): 1206; Min Operating Temperature: -55°C; Max Operating Temperature: 125°C; Packaging: Tape and Reel; Package Quantity: 5000; Tolerance: 1%; Max Power Dissipation: 125mW; Termination: SMD/SMT; Series: TFPT; Resistance Tolerance: 1%; Length: 3.2mm; Width: 1.6mm; Height: 0.55mm; Lead Free: Lead Free; RoHS Compliant: Yes; ComponentLink1URL: https://datasheet.ciiva.com/2852/tfpt-2852076.pdf?src-supplier=Digikey; ComponentLink1Description: https://datasheet.ciiva.com/2852/tfpt-2852076.pdf?src-supplier=Digikey
S1 = LHI 878/3902: Sensor PIR (Passive Infrared) TO-205AA, TO-5-3 Metal Can; Manufacturer: Excelitas; DESIGNED BY: MFY; Max Supply Voltage: 12V; Min Supply Voltage: 2V; Supplier: Newark; Supplier Part Number: 61T6571; Manufacturer Part Number: LHI878/3902; RoHS: No; Category: Linear ICs; Case/Package: TO-205AA
U8 = OPA 314: OPAMP OPA 314; Manufacturer: Texas Instruments; Package Body Material: Plastic; Amplifier Type: OPERATIONAL AMPLIFIER; Architecture: VOLTAGE-FEEDBACK; Average Bias Current-Max (IIB): 600pA; Bias Current-Max (IIB) @25C: 10pA; Common Mode Rejection Ratio-Min: 60dB; Common-mode Reject Ratio-Nom: 90dB; Frequency Compensation: YES; Input Offset Voltage-Max: 2.5mV; Low-Offset: No; Channels: 1; Package Equivalence Code: TSOP5/6,.11,37; Power Supplies: +-0.9/+-2.75/1.8/5.5V; Slew Rate: 1.5V/µs; Max Supply Current: 180uA; Supply Voltage Limit-Max: 7V; Nominal Supply Voltage: 5V; Unity Gain BW-Nom: 3MHz; Voltage Gain-Min: 31620; Qualification Status: Not Qualified; Supplier: Mouser; Supplier Part Number: 595-OPA314AIDBVR; Manufacturer Part Number: OPA314AIDBVR; RoHS: Yes; Category: Amplifiers - Op Amps, Buffer, Instrumentation; Stock: 944; Pricing: 1=1,19, 10=0,861, 50=0,775, 100=0,682, 1000=0,589, 10000=0,537 (USD); Case/Package: LSSOP; Pins: 5; Package Shape: Rectangular; Terminal Finish: Nickel; Min Operating Temperature: -40°C; Max Operating Temperature: 125°C; JESD-609 Code: e4; JESD-30 Code: R-PDSO-G5; Low-Bias: Yes; Micropower: Yes; Moisture Sensitivity Level: 2; Package Style: SMALL OUTLINE, LOW PROFILE, SHRINK PITCHMeter; Packaging: Tape and Reel; Peak Reflow Temperature (Cel): 260°C; Power: No; Programmable Power: No; Surface Mount: Yes; Technology: CMOS; Terminal Form: Gull Wing; Terminal Position: DUAL; Wideband: No; Length: 2.9mm; Width: 1.6mm; Height - Seated (Max): 1.45mm; Terminal Pitch: 0.95mm; Temperature Grade: AUTOMOTIVE; Reach SVHC Compliant: Yes; RoHS Compliant: Yes; ComponentLink1URL: https://www.ti.com:443/lit/ds/symlink/opa2314.pdf?src-supplier=IHS+Markit; ComponentLink1Description: https://www.ti.com:443/lit/ds/symlink/opa2314.pdf?src-supplier=IHS+Markit; ComponentLink2URL: https://datasheet.ciiva.com/14462/opa2314-14462006.pdf?src-supplier=Avnet; ComponentLink2Description: https://datasheet.ciiva.com/14462/opa2314-14462006.pdf?src-supplier=Avnet; ComponentLink3URL: https://datasheet.ciiva.com/29638/opa314-29638827.pdf?src-supplier=Digikey; ComponentLink3Description: https://datasheet.ciiva.com/29638/opa314-29638827.pdf?src-supplier=Digikey; ComponentLink4URL: https://datasheet.ciiva.com/14456/opa2314-14456281.pdf?src-supplier=Avnet; ComponentLink4Description: https://datasheet.ciiva.com/14456/opa2314-14456281.pdf?src-supplier=Avnet
U9 = NCS36000: PIR CONTROLLER Analog Circuit, 1 Func, CMOS, PDSO14; Manufacturer: onsemi; Package Body Material: Plastic; Channels: 1; Package Equivalence Code: SOP14,.25; Power Supplies: 3.3/5V; Max Supply Voltage: 5.75V; Min Supply Voltage: 3V; Nominal Supply Voltage: 5V; Qualification Status: Not Qualified; Supplier: Farnell; Supplier Part Number: 2531200; Manufacturer Part Number: NCS36000DRG; RoHS: Yes; Category: Amplifiers - Op Amps, Buffer, Instrumentation; Pricing: 1=0,698, 50=0,609, 100=0,468, 250=0,442, 500=0,414, 1000=0,326, 2500=0,29, 5000=0,282 (EUR); Case/Package: SOP; Pins: 14; Package Shape: Rectangular; Terminal Finish: Tin; Min Operating Temperature: -40°C; Max Operating Temperature: 85°C; JESD-609 Code: e3; Throw Configuration: ANALOG CIRCUIT; JESD-30 Code: R-PDSO-G14; Moisture Sensitivity Level: 2; Package Style: SMALL OUTLINEMeter; Surface Mount: Yes; Technology: CMOS; Terminal Form: Gull Wing; Terminal Position: DUAL; Length: 8.65mm; Width: 3.9mm; Height - Seated (Max): 1.75mm; Terminal Pitch: 1.27mm; Temperature Grade: INDUSTRIAL; Reach SVHC Compliant: Yes; RoHS Compliant: Yes; ComponentLink1URL: https://datasheet.ciiva.com:443/pdfs/VipMasterIC/IC/ONSM/ONSM-S-A0001345293/ONSM-S-A0001345293-1.pdf?src-supplier=IHS+Markit; ComponentLink1Description: https://datasheet.ciiva.com:443/pdfs/VipMasterIC/IC/ONSM/ONSM-S-A0001345293/ONSM-S-A0001345293-1.pdf?src-supplier=IHS+Markit; ComponentLink2URL: https://datasheet.ciiva.com/1781/ncs36000-d-1781637.pdf?src-supplier=Digikey; ComponentLink2Description: https://datasheet.ciiva.com/1781/ncs36000-d-1781637.pdf?src-supplier=Digikey; ComponentLink3URL: https://datasheet.ciiva.com/4763/ncs36000-d-89569-4763639.pdf?src-supplier=Mouser; ComponentLink3Description: https://datasheet.ciiva.com/4763/ncs36000-d-89569-4763639.pdf?src-supplier=Mouser; ComponentLink4URL: https://datasheet.ciiva.com/2965/ncs36000-d-2965212.pdf?src-supplier=Avnet; ComponentLink4Description: https://datasheet.ciiva.com/2965/ncs36000-d-2965212.pdf?src-supplier=Avnet; ComponentLink5URL: https://datasheet.ciiva.com/1781/ncs36000-d-1781639.pdf?src-supplier=Digikey; ComponentLink5Description: https://datasheet.ciiva.com/1781/ncs36000-d-1781639.pdf?src-supplier=Digikey; ComponentLink6URL: https://datasheet.ciiva.com/2966/ncs36000-d-2966525.pdf?src-supplier=Avnet; ComponentLink6Description: https://datasheet.ciiva.com/2966/ncs36000-d-2966525.pdf?src-supplier=Avnet